# Altium project jetson-orin-baseboard.PrjPcb (part 3 of 5)

## Sheet csi.SchDoc
size 420 x 297 mm
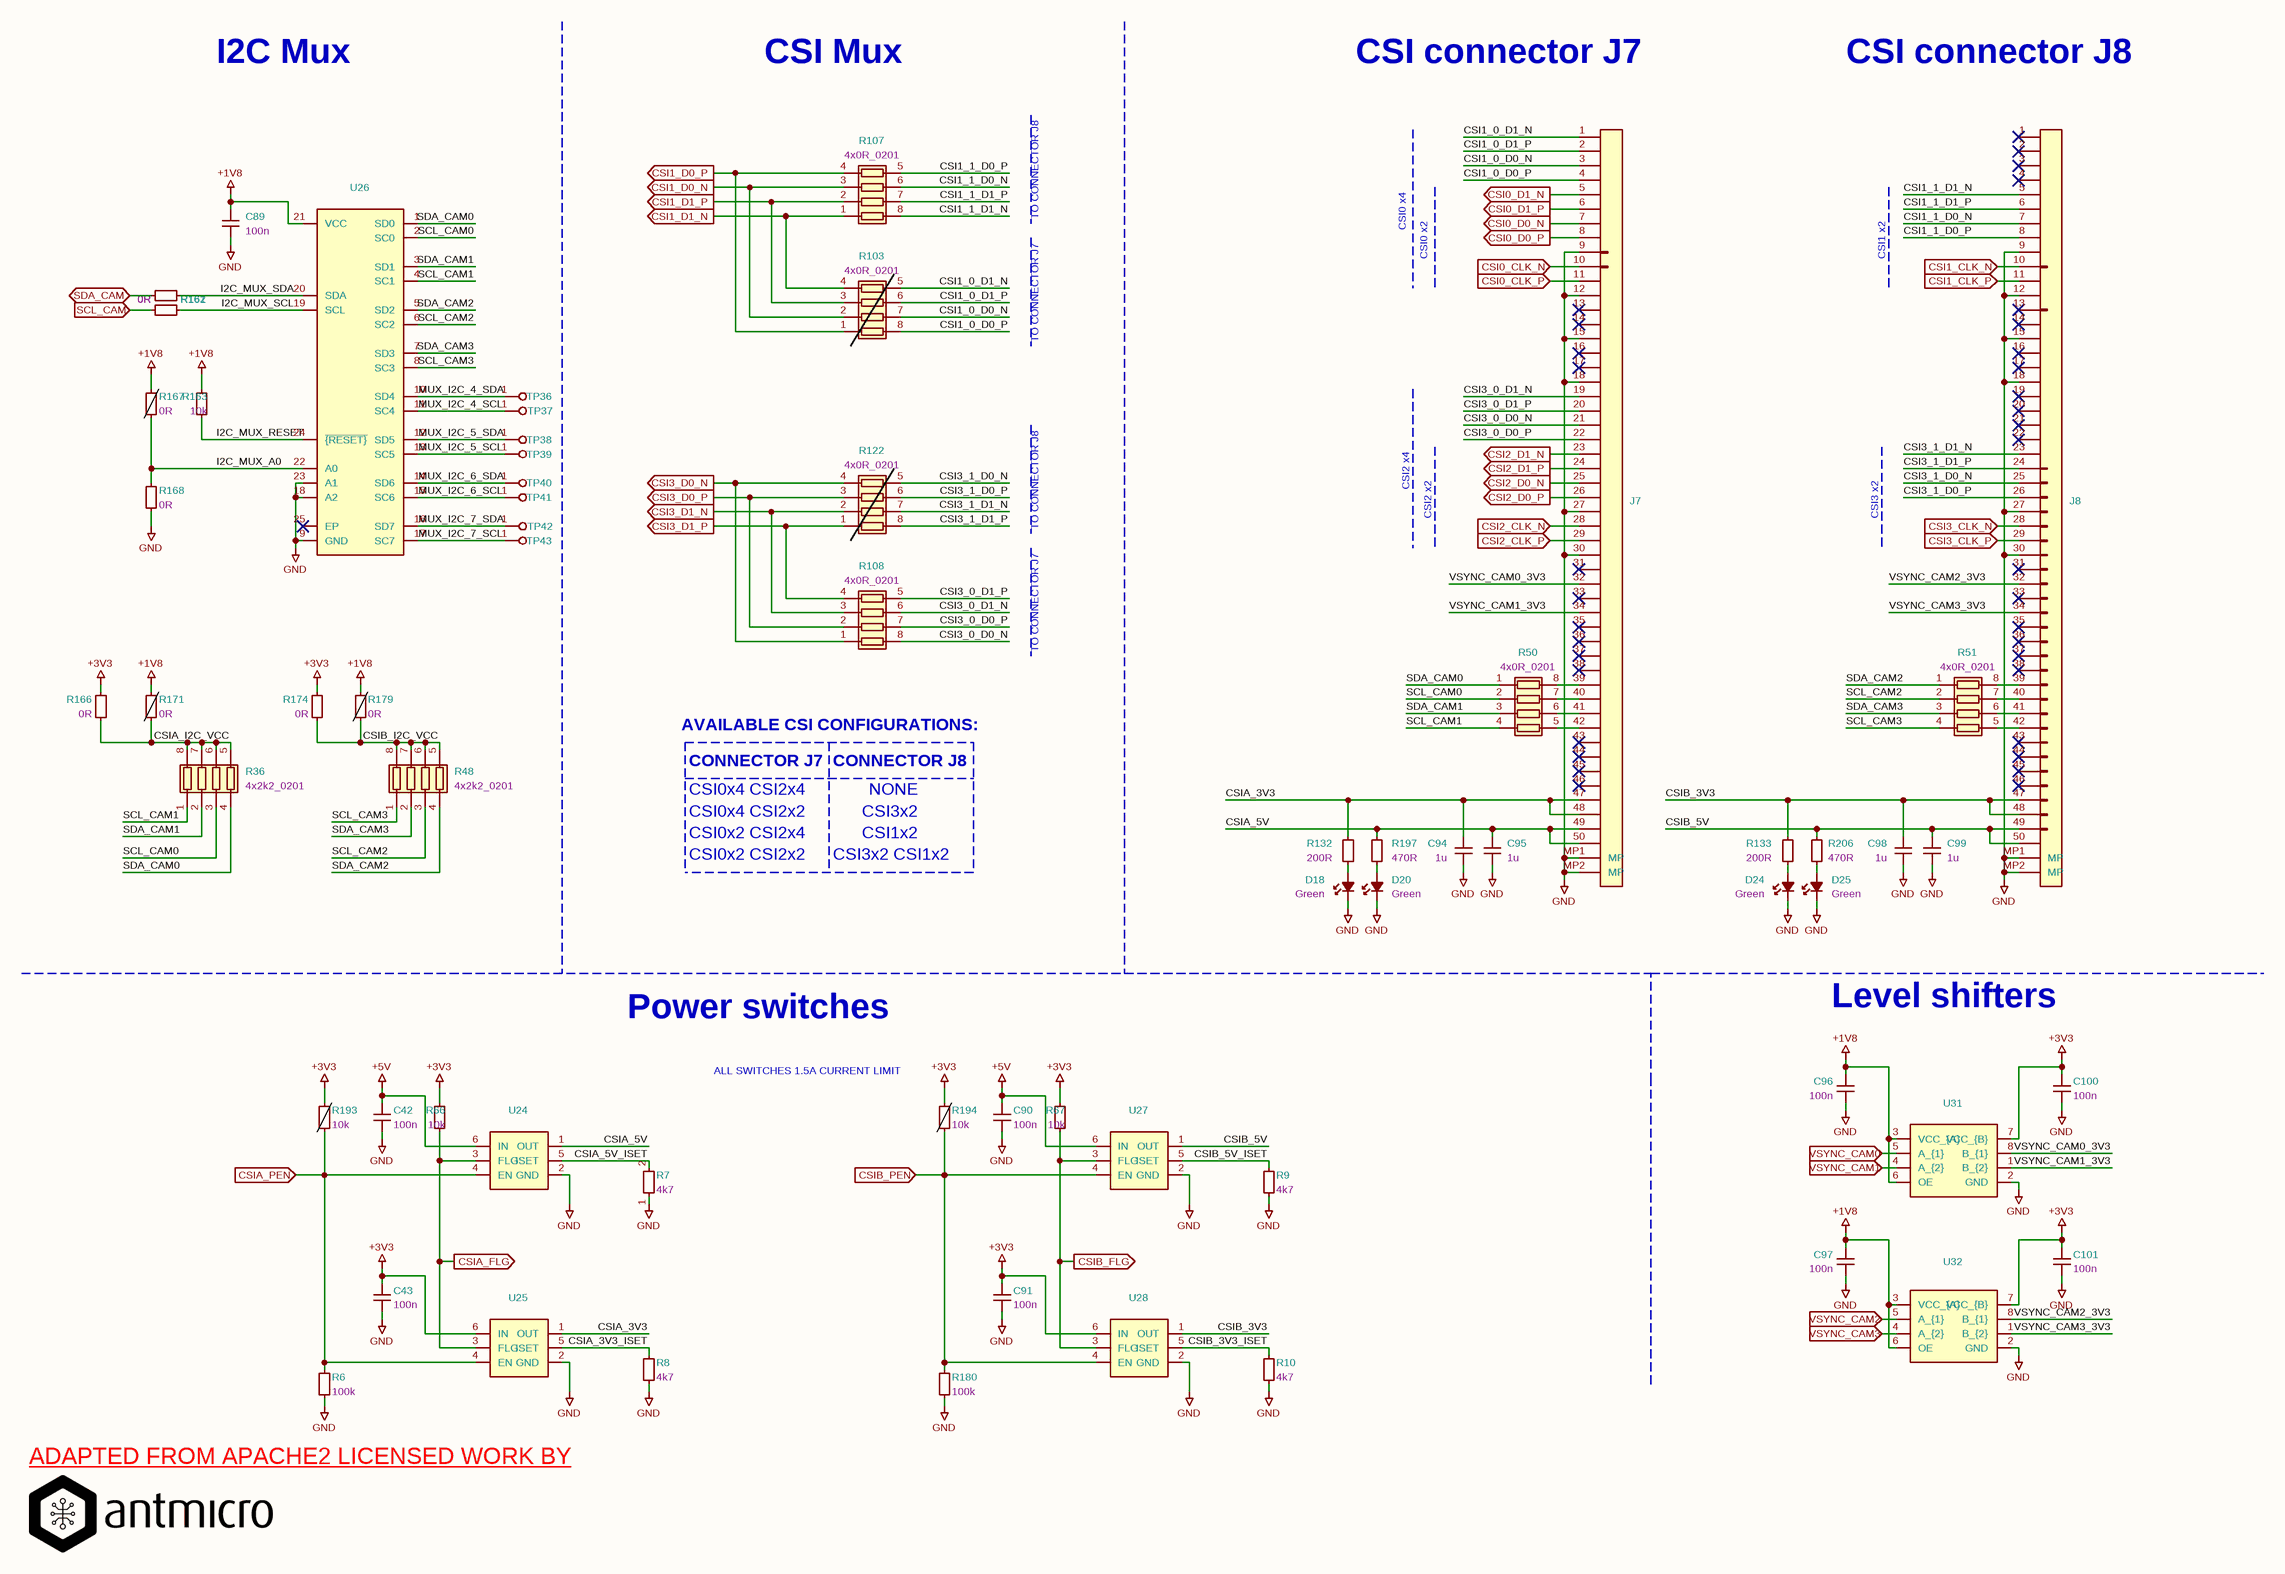
[diagram p7: csi.SchDoc]

### Parts
C42  Val: 100n  [C_0402_1005Metric]  (hidden comment: GRM155R61H104KE14D)
C43  Val: 100n  [C_0402_1005Metric]  (hidden comment: GRM155R61H104KE14D)
C89  Val: 100n  [C_0402_1005Metric]  (hidden comment: GRM155R61H104KE14D)
C90  Val: 100n  [C_0402_1005Metric]  (hidden comment: GRM155R61H104KE14D)
C91  Val: 100n  [C_0402_1005Metric]  (hidden comment: GRM155R61H104KE14D)
C94  Val: 1u  [C_0402_1005Metric]  (hidden comment: C1005X6S1A105K050BC)
C95  Val: 1u  [C_0402_1005Metric]  (hidden comment: C1005X6S1A105K050BC)
C96  Val: 100n  [C_0402_1005Metric]  (hidden comment: GRM155R61H104KE14D)
C97  Val: 100n  [C_0402_1005Metric]  (hidden comment: GRM155R61H104KE14D)
C98  Val: 1u  [C_0402_1005Metric]  (hidden comment: C1005X6S1A105K050BC)
C99  Val: 1u  [C_0402_1005Metric]  (hidden comment: C1005X6S1A105K050BC)
C100  Val: 100n  [C_0402_1005Metric]  (hidden comment: GRM155R61H104KE14D)
C101  Val: 100n  [C_0402_1005Metric]  (hidden comment: GRM155R61H104KE14D)
D18  Color: Green  [LED_0603_1608Metric_G]  (hidden comment: LTST-C190GKT)
D20  Color: Green  [LED_0603_1608Metric_G]  (hidden comment: LTST-C190GKT)
D24  Color: Green  [LED_0603_1608Metric_G]  (hidden comment: LTST-C190GKT)
D25  Color: Green  [LED_0603_1608Metric_G]  (hidden comment: LTST-C190GKT)
J7  68715014522  [Conn_FFC_WE_68715014x22]  (value not drawn)
J8  68715014522  [Conn_FFC_WE_68715014x22]  (value not drawn)
R6  Val: 100k  [R_0402_1005Metric]  (hidden comment: CR0402-FX-1003GLF)
R7  Val: 4k7  [R_0402_1005Metric]  (hidden comment: CR0402-FX-4701GLF)
R8  Val: 4k7  [R_0402_1005Metric]  (hidden comment: CR0402-FX-4701GLF)
R9  Val: 4k7  [R_0402_1005Metric]  (hidden comment: CR0402-FX-4701GLF)
R10  Val: 4k7  [R_0402_1005Metric]  (hidden comment: CR0402-FX-4701GLF)
R36  Val: 4x2k2_0201  [R_Array_4x0201_Panasonic_EXB18V]  (hidden comment: EXB-18V222JX)
R48  Val: 4x2k2_0201  [R_Array_4x0201_Panasonic_EXB18V]  (hidden comment: EXB-18V222JX)
R50  Val: 4x0R_0201  [R_Array_4x0201_Panasonic_EXB18V]  (hidden comment: EXB-18VR000X)
R51  Val: 4x0R_0201  [R_Array_4x0201_Panasonic_EXB18V]  (hidden comment: EXB-18VR000X)
R66  Val: 10k  [R_0402_1005Metric]  (hidden comment: CR0402-FX-1002GLF)
R67  Val: 10k  [R_0402_1005Metric]  (hidden comment: CR0402-FX-1002GLF)
R103  Val: 4x0R_0201  [R_Array_4x0201_Panasonic_EXB18V]  (hidden comment: EXB-18VR000X)  (no BOM)
R107  Val: 4x0R_0201  [R_Array_4x0201_Panasonic_EXB18V]  (hidden comment: EXB-18VR000X)
R108  Val: 4x0R_0201  [R_Array_4x0201_Panasonic_EXB18V]  (hidden comment: EXB-18VR000X)
R122  Val: 4x0R_0201  [R_Array_4x0201_Panasonic_EXB18V]  (hidden comment: EXB-18VR000X)  (no BOM)
R132  Val: 200R  [R_0402_1005Metric]  (hidden comment: CR0402-FX-2000GLF)
R133  Val: 200R  [R_0402_1005Metric]  (hidden comment: CR0402-FX-2000GLF)
R161  Val: 0R  [R_0402_1005Metric]  (hidden comment: ERJ2GE0R00X)
R162  Val: 0R  [R_0402_1005Metric]  (hidden comment: ERJ2GE0R00X)
R163  Val: 10k  [R_0402_1005Metric]  (hidden comment: CR0402-FX-1002GLF)
R166  Val: 0R  [R_0402_1005Metric]  (hidden comment: ERJ2GE0R00X)
R167  Val: 0R  [R_0402_1005Metric]  (hidden comment: ERJ2GE0R00X)  (no BOM)
R168  Val: 0R  [R_0402_1005Metric]  (hidden comment: ERJ2GE0R00X)
R171  Val: 0R  [R_0402_1005Metric]  (hidden comment: ERJ2GE0R00X)  (no BOM)
R174  Val: 0R  [R_0402_1005Metric]  (hidden comment: ERJ2GE0R00X)
R179  Val: 0R  [R_0402_1005Metric]  (hidden comment: ERJ2GE0R00X)  (no BOM)
R180  Val: 100k  [R_0402_1005Metric]  (hidden comment: CR0402-FX-1003GLF)
R193  Val: 10k  [R_0402_1005Metric]  (hidden comment: CR0402-FX-1002GLF)  (no BOM)
R194  Val: 10k  [R_0402_1005Metric]  (hidden comment: CR0402-FX-1002GLF)  (no BOM)
R197  Val: 470R  [R_0402_1005Metric]  (hidden comment: CR0402-FX-4700GLF)
R206  Val: 470R  [R_0402_1005Metric]  (hidden comment: CR0402-FX-4700GLF)
TP36  TP_0.75mm_SMD  [TP_SMD_0.75mm]  (value not drawn)  (no BOM)
TP37  TP_0.75mm_SMD  [TP_SMD_0.75mm]  (value not drawn)  (no BOM)
TP38  TP_0.75mm_SMD  [TP_SMD_0.75mm]  (value not drawn)  (no BOM)
TP39  TP_0.75mm_SMD  [TP_SMD_0.75mm]  (value not drawn)  (no BOM)
TP40  TP_0.75mm_SMD  [TP_SMD_0.75mm]  (value not drawn)  (no BOM)
TP41  TP_0.75mm_SMD  [TP_SMD_0.75mm]  (value not drawn)  (no BOM)
TP42  TP_0.75mm_SMD  [TP_SMD_0.75mm]  (value not drawn)  (no BOM)
TP43  TP_0.75mm_SMD  [TP_SMD_0.75mm]  (value not drawn)  (no BOM)
U24  AP22615AWU-7  [TSOT23-6]  (value not drawn)
U25  AP22615AWU-7  [TSOT23-6]  (value not drawn)
U26  PI4MSD5V9548AZDEX  [VQFN-24-1EP_3.8x3.8x1.0mm_P0.5mm]  (value not drawn)
U27  AP22615AWU-7  [TSOT23-6]  (value not drawn)
U28  AP22615AWU-7  [TSOT23-6]  (value not drawn)
U31  NTS0102GT  [XSON-8_1x1.95mm_P0.5mm]  (value not drawn)
U32  NTS0102GT  [XSON-8_1x1.95mm_P0.5mm]  (value not drawn)

### Ports
CSI0_CLK_N (in), CSI0_CLK_P (in), CSI0_D0_N (out), CSI0_D0_P (out), CSI0_D1_N (out), CSI0_D1_P (out), CSI1_CLK_N (in), CSI1_CLK_P (in), CSI1_D0_N (out), CSI1_D0_P (out), CSI1_D1_N (out), CSI1_D1_P (out), CSI2_CLK_N (in), CSI2_CLK_P (in), CSI2_D0_N (out), CSI2_D0_P (out), CSI2_D1_N (out), CSI2_D1_P (out), CSI3_CLK_N (in), CSI3_CLK_P (in), CSI3_D0_N (out), CSI3_D0_P (out), CSI3_D1_N (out), CSI3_D1_P (out), CSIA_FLG (out), CSIA_PEN (in), CSIB_FLG (out), CSIB_PEN (in), SCL_CAM (in), SDA_CAM (bidir), VSYNC_CAM0 (in), VSYNC_CAM1 (in), VSYNC_CAM2 (in), VSYNC_CAM3 (in)

### Nets
+1V8: C89.2 C96.2 C97.2 R163.1 R167.2 R171.2 R179.2 U26.21(VCC) U31.3(VCC_{A}) U31.6(OE) U32.3(VCC_{A}) U32.6(OE)
+3V3: C43.1 C91.1 C100.2 C101.2 R66.1 R67.1 R166.2 R174.2 R193.2 R194.2 U25.6(IN) U28.6(IN) U31.7(VCC_{B}) U32.7(VCC_{B})
+5V: C42.1 C90.1 U24.6(IN) U27.6(IN)
GND: C42.2 C43.2 C89.1 C90.2 C91.2 C94.1 C95.1 C96.1 C97.1 C98.1 C99.1 C100.1 C101.1 D18.1(C) D20.1(C) D24.1(C) D25.1(C) J7.9 J7.12 J7.15 J7.18 J7.27 J7.30 J7.MP1(MP) J7.MP2(MP) J8.9 J8.12 J8.15 J8.18 J8.27 J8.30 J8.MP1(MP) J8.MP2(MP) R6.1 R7.1 R8.1 R9.1 R10.1 R168.1 R180.1 U24.2(GND) U25.2(GND) U26.9(GND) U26.18(A2) U26.23(A1) U27.2(GND) U28.2(GND) U31.2(GND) U32.2(GND)
CSI0_CLK_N: J7.10 ; port CSI0_CLK_N
CSI0_CLK_P: J7.11 ; port CSI0_CLK_P
CSI0_D0_N: J7.7 ; port CSI0_D0_N
CSI0_D0_P: J7.8 ; port CSI0_D0_P
CSI0_D1_N: J7.5 ; port CSI0_D1_N
CSI0_D1_P: J7.6 ; port CSI0_D1_P
CSI1_0_D0_N: J7.3 R103.7(R2.2)
CSI1_0_D0_P: J7.4 R103.8(R1.2)
CSI1_0_D1_N: J7.1 R103.5(R4.2)
CSI1_0_D1_P: J7.2 R103.6(R3.2)
CSI1_1_D0_N: J8.7 R107.6(R3.2)
CSI1_1_D0_P: J8.8 R107.5(R4.2)
CSI1_1_D1_N: J8.5 R107.8(R1.2)
CSI1_1_D1_P: J8.6 R107.7(R2.2)
CSI1_CLK_N: J8.10 ; port CSI1_CLK_N
CSI1_CLK_P: J8.11 ; port CSI1_CLK_P
CSI1_D0_N: R103.2(R2.1) R107.3(R3.1) ; port CSI1_D0_N
CSI1_D0_P: R103.1(R1.1) R107.4(R4.1) ; port CSI1_D0_P
CSI1_D1_N: R103.4(R4.1) R107.1(R1.1) ; port CSI1_D1_N
CSI1_D1_P: R103.3(R3.1) R107.2(R2.1) ; port CSI1_D1_P
CSI2_CLK_N: J7.28 ; port CSI2_CLK_N
CSI2_CLK_P: J7.29 ; port CSI2_CLK_P
CSI2_D0_N: J7.25 ; port CSI2_D0_N
CSI2_D0_P: J7.26 ; port CSI2_D0_P
CSI2_D1_N: J7.23 ; port CSI2_D1_N
CSI2_D1_P: J7.24 ; port CSI2_D1_P
CSI3_0_D0_N: J7.21 R108.8(R1.2)
CSI3_0_D0_P: J7.22 R108.7(R2.2)
CSI3_0_D1_N: J7.19 R108.6(R3.2)
CSI3_0_D1_P: J7.20 R108.5(R4.2)
CSI3_1_D0_N: J8.25 R122.5(R4.2)
CSI3_1_D0_P: J8.26 R122.6(R3.2)
CSI3_1_D1_N: J8.23 R122.7(R2.2)
CSI3_1_D1_P: J8.24 R122.8(R1.2)
CSI3_CLK_N: J8.28 ; port CSI3_CLK_N
CSI3_CLK_P: J8.29 ; port CSI3_CLK_P
CSI3_D0_N: R108.1(R1.1) R122.4(R4.1) ; port CSI3_D0_N
CSI3_D0_P: R108.2(R2.1) R122.3(R3.1) ; port CSI3_D0_P
CSI3_D1_N: R108.3(R3.1) R122.2(R2.1) ; port CSI3_D1_N
CSI3_D1_P: R108.4(R4.1) R122.1(R1.1) ; port CSI3_D1_P
CSIA_3V3: C94.2 J7.47 J7.48 R132.2 U25.1(OUT)
CSIA_3V3_ISET: R8.2 U25.5(ISET)
CSIA_5V: C95.2 J7.49 J7.50 R197.2 U24.1(OUT)
CSIA_5V_ISET: R7.2 U24.5(ISET)
CSIA_FLG: R66.2 U24.3(FLG) U25.3(FLG) ; port CSIA_FLG
CSIA_I2C_VCC: R36.5(R4.2) R36.6(R3.2) R36.7(R2.2) R36.8(R1.2) R166.1 R171.1
CSIA_PEN: R6.2 R193.1 U24.4(EN) U25.4(EN) ; port CSIA_PEN
CSIB_3V3: C98.2 J8.47 J8.48 R133.2 U28.1(OUT)
CSIB_3V3_ISET: R10.2 U28.5(ISET)
CSIB_5V: C99.2 J8.49 J8.50 R206.2 U27.1(OUT)
CSIB_5V_ISET: R9.2 U27.5(ISET)
CSIB_FLG: R67.2 U27.3(FLG) U28.3(FLG) ; port CSIB_FLG
CSIB_I2C_VCC: R48.5(R4.2) R48.6(R3.2) R48.7(R2.2) R48.8(R1.2) R174.1 R179.1
CSIB_PEN: R180.2 R194.1 U27.4(EN) U28.4(EN) ; port CSIB_PEN
I2C_MUX_A0: R167.1 R168.2 U26.22(A0)
I2C_MUX_RESET: R163.2 U26.24(~{{RESET}})
I2C_MUX_SCL: R162.1 U26.19(SCL)
I2C_MUX_SDA: R161.1 U26.20(SDA)
MUX_I2C_4_SCL: TP37.1 U26.11(SC4)
MUX_I2C_4_SDA: TP36.1 U26.10(SD4)
MUX_I2C_5_SCL: TP39.1 U26.13(SC5)
MUX_I2C_5_SDA: TP38.1 U26.12(SD5)
MUX_I2C_6_SCL: TP41.1 U26.15(SC6)
MUX_I2C_6_SDA: TP40.1 U26.14(SD6)
MUX_I2C_7_SCL: TP43.1 U26.17(SC7)
MUX_I2C_7_SDA: TP42.1 U26.16(SD7)
SCL_CAM: R162.2 ; port SCL_CAM
SCL_CAM0: R36.3(R3.1) R50.2(R2.1) U26.2(SC0)
SCL_CAM1: R36.1(R1.1) R50.4(R4.1) U26.4(SC1)
SCL_CAM2: R48.3(R3.1) R51.2(R2.1) U26.6(SC2)
SCL_CAM3: R48.1(R1.1) R51.4(R4.1) U26.8(SC3)
SDA_CAM: R161.2 ; port SDA_CAM
SDA_CAM0: R36.4(R4.1) R50.1(R1.1) U26.1(SD0)
SDA_CAM1: R36.2(R2.1) R50.3(R3.1) U26.3(SD1)
SDA_CAM2: R48.4(R4.1) R51.1(R1.1) U26.5(SD2)
SDA_CAM3: R48.2(R2.1) R51.3(R3.1) U26.7(SD3)
VSYNC_CAM0: U31.5(A_{1}) ; port VSYNC_CAM0
VSYNC_CAM0_3V3: J7.32 U31.8(B_{1})
VSYNC_CAM1: U31.4(A_{2}) ; port VSYNC_CAM1
VSYNC_CAM1_3V3: J7.34 U31.1(B_{2})
VSYNC_CAM2: U32.5(A_{1}) ; port VSYNC_CAM2
VSYNC_CAM2_3V3: J8.32 U32.8(B_{1})
VSYNC_CAM3: U32.4(A_{2}) ; port VSYNC_CAM3
VSYNC_CAM3_3V3: J8.34 U32.1(B_{2})
NetD18_2: D18.2(A) R132.1
NetD20_2: D20.2(A) R197.1
NetD24_2: D24.2(A) R133.1
NetD25_2: D25.2(A) R206.1
NetJ7_39: J7.39 R50.8(R1.2)
NetJ7_40: J7.40 R50.7(R2.2)
NetJ7_41: J7.41 R50.6(R3.2)
NetJ7_42: J7.42 R50.5(R4.2)
NetJ8_39: J8.39 R51.8(R1.2)
NetJ8_40: J8.40 R51.7(R2.2)
NetJ8_41: J8.41 R51.6(R3.2)
NetJ8_42: J8.42 R51.5(R4.2)

Not connected (* = marked no-connect by the designer): J7 13* 14* 16* 17* 31* 33* 35* 36* 37* 38* 43* 44* 45* 46*; J8 1* 2* 3* 4* 13* 14* 16* 17* 19* 20* 21* 22* 31* 33* 35* 36* 37* 38* 43* 44* 45* 46*; U26 25(EP)*

### Notes on the sheet
- I2C Mux
- CSI Mux
- CSI connector J7
- CSI connector J8
- TO CONNECTOR J8
- CSI0 x4
- CSI0 x2
- CSI1 x2
- TO CONNECTOR J7
- CSI2 x4
- CSI2 x2
- CSI3 x2
- AVAILABLE CSI CONFIGURATIONS:
- CONNECTOR J7
- CSI0x4 CSI2x4
- CONNECTOR J8
- NONE
- CSI0x2 CSI2x2
- CSI0x4 CSI2x2
- CSI0x2 CSI2x4
- CSI3x2 CSI1x2
- CSI1x2
- CSI3x2
- Level shifters
- Power switches
- ALL SWITCHES
  1.5A CURRENT LIMIT
- (near R6) ADAPTED FROM APACHE2 LICENSED WORK BY <https://github.com/antmicro/jetson-orin-baseboard>
- 1
- 2
- 3
- 4
- 5
- 6
- 7
- 8
- A
- B
- C
- D
- E
- www.antmicro.com <http://www.antmicro.com>
- Title: Jetson Orin Baseboard
- File: csi.kicad_sch
- Sheet: /
- Antmicro Ltd
- F
- KiCad E.D.A.  kicad (5.1.4)-1
- Size: A3
- Date: 2025-01-15
- Rev: 1.3.0
- Id: 1/1

### Library data of the parts
C42 C43 C89-C91 C96 C97 C100 C101 = C_100n_0402: Manufacturer 1: Murata; License: Apache-2.0; Voltage: 50V; Dielectric: X5R; Author: Antmicro; OldValue: C_100n_0402; Manufacturer Part Number 1: GRM155R61H104KE14D; Value: GRM155R61H104KE14D; Footprint: antmicro-footprints:C_0402_1005Metric
C94 C95 C98 C99 = C_1u_0402: Manufacturer 1: TDK; License: Apache-2.0; Author: Antmicro; OldValue: C_1u_0402; Manufacturer Part Number 1: C1005X6S1A105K050BC; Value: C1005X6S1A105K050BC; Footprint: antmicro-footprints:C_0402_1005Metric
D18 D20 D24 D25 = LED_G_0603_LTST-C190GKT: Manufacturer 1: Lite-On; License: Apache-2.0; Author: Antmicro; OldValue: LED_G_0603_LTST-C190GKT; Manufacturer Part Number 1: LTST-C190GKT; Value: LTST-C190GKT; Footprint: antmicro-footprints:LED_0603_1608Metric_G
J7 J8 = Conn_FFC_WE_68715014522: Manufacturer 1: Würth Elektronik; License: Apache-2.0; Author: Antmicro; OldValue: Conn_FFC_WE_68715014522; Manufacturer Part Number 1: 68715014522; Value: 68715014522; Footprint: antmicro-footprints:Conn_FFC_WE_68715014x22
R6 R180 = R_100k_0402: Manufacturer 1: Bourns; License: Apache-2.0; Tolerance: 1%; Author: Antmicro; OldValue: R_100k_0402; Manufacturer Part Number 1: CR0402-FX-1003GLF; Value: CR0402-FX-1003GLF; Footprint: antmicro-footprints:R_0402_1005Metric
R7-R10 = R_4k7_0402: Manufacturer 1: Bourns; License: Apache-2.0; Tolerance: 1%; Author: Antmicro; OldValue: R_4k7_0402; Manufacturer Part Number 1: CR0402-FX-4701GLF; Value: CR0402-FX-4701GLF; Footprint: antmicro-footprints:R_0402_1005Metric
R36 R48 = R_4x2k2_0201_array: Manufacturer 1: Panasonic; License: Apache-2.0; Author: Antmicro; OldValue: R_4x2k2_0201_array; Manufacturer Part Number 1: EXB-18V222JX; Value: EXB-18V222JX; Footprint: antmicro-footprints:R_Array_4x0201_Panasonic_EXB18V
R50 R51 R103 R107 R108 R122 = R_4x0R_0201_array: Manufacturer 1: Panasonic; License: Apache-2.0; Author: Antmicro; OldValue: R_4x0R_0201_array; Manufacturer Part Number 1: EXB-18VR000X; Value: EXB-18VR000X; Footprint: antmicro-footprints:R_Array_4x0201_Panasonic_EXB18V
R66 R67 R163 R193 R194 = R_10k_0402: Manufacturer 1: Bourns; License: Apache-2.0; Tolerance: 1%; Author: Antmicro; OldValue: R_10k_0402; Manufacturer Part Number 1: CR0402-FX-1002GLF; Value: CR0402-FX-1002GLF; Footprint: antmicro-footprints:R_0402_1005Metric
R132 R133 = R_200R_0402: Manufacturer 1: Bourns; License: Apache-2.0; Tolerance: 1%; Author: Antmicro; OldValue: R_200R_0402; Manufacturer Part Number 1: CR0402-FX-2000GLF; Value: CR0402-FX-2000GLF; Footprint: antmicro-footprints:R_0402_1005Metric
R161 R162 R166-R168 R171 R174 R179 = R_0R_0402: as R1-R5 on sheet som; Author: Antmicro; OldValue: R_0R_0402; Manufacturer Part Number 1: ERJ2GE0R00X; Value: ERJ2GE0R00X; Footprint: antmicro-footprints:R_0402_1005Metric
R197 R206 = R_470R_0402: Manufacturer 1: Bourns; License: Apache-2.0; Tolerance: 1%; Author: Antmicro; OldValue: R_470R_0402; Manufacturer Part Number 1: CR0402-FX-4700GLF; Value: CR0402-FX-4700GLF; Footprint: antmicro-footprints:R_0402_1005Metric
TP36-TP43 = TP_0.75mm_SMD: License: Apache-2.0; Author: Antmicro; OldValue: TP_0.75mm_SMD; Value: TP_0.75mm_SMD; Footprint: antmicro-footprints:TP_SMD_0.75mm
U24 U25 U27 U28 = AP22615A_TSOT26: Manufacturer 1: Diodes Incorporated; License: Apache-2.0; Author: Antmicro; OldValue: AP22615A_TSOT26; Manufacturer Part Number 1: AP22615AWU-7; Value: AP22615AWU-7; Footprint: antmicro-footprints:TSOT23-6
U26 = PI4MSD5V9548AZDEX: Manufacturer 1: Diodes Incorporated; License: Apache-2.0; Author: Antmicro; OldValue: PI4MSD5V9548AZDEX; Manufacturer Part Number 1: PI4MSD5V9548AZDEX; Value: PI4MSD5V9548AZDEX; Footprint: antmicro-footprints:VQFN-24-1EP_3.8x3.8x1.0mm_P0.5mm
U31 U32 = NTS0102_XSON: Manufacturer 1: NXP; License: Apache-2.0; Author: Antmicro; OldValue: NTS0102_XSON; Manufacturer Part Number 1: NTS0102GT; Value: NTS0102GT; Footprint: antmicro-footprints:XSON-8_1x1.95mm_P0.5mm

## Sheet m-2.SchDoc
size 420 x 297 mm
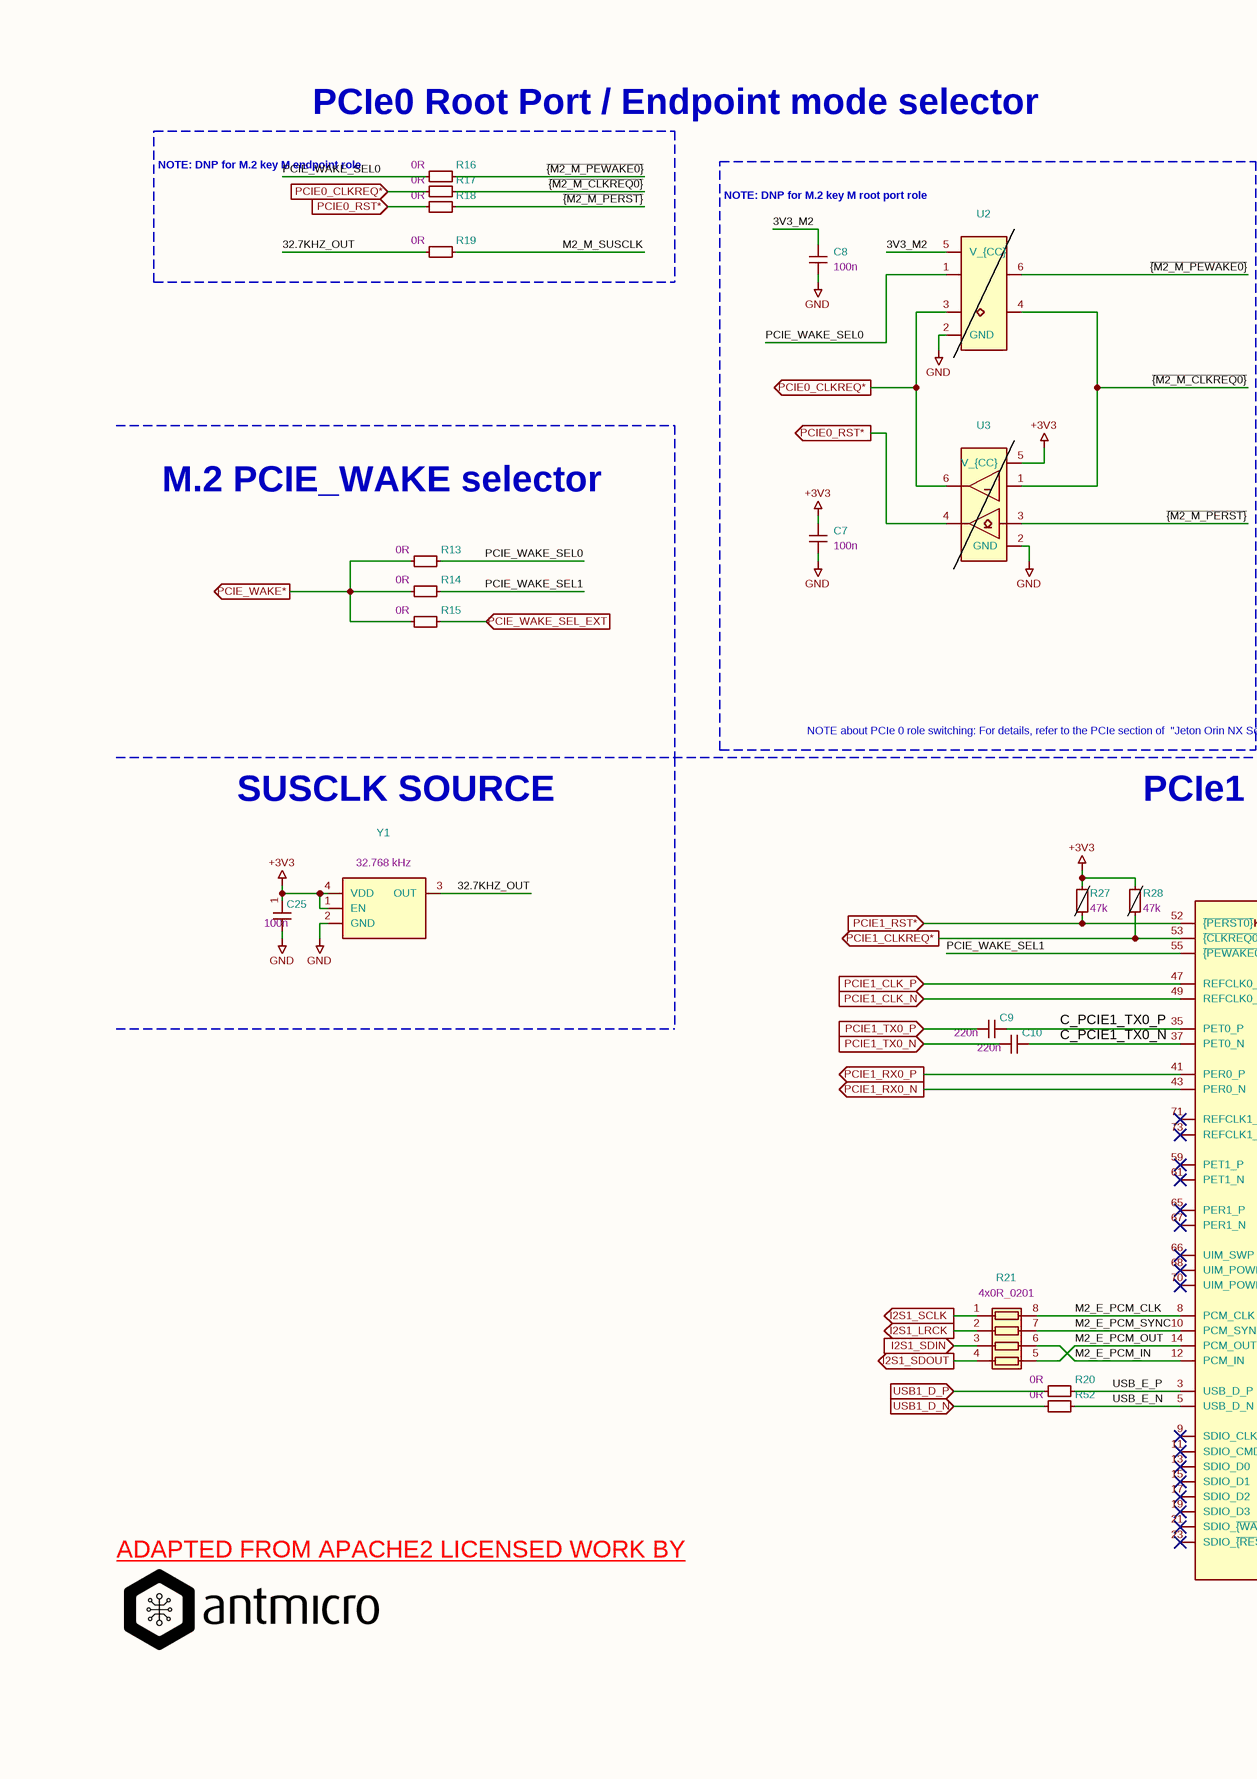
[diagram p8: m-2.SchDoc, left]
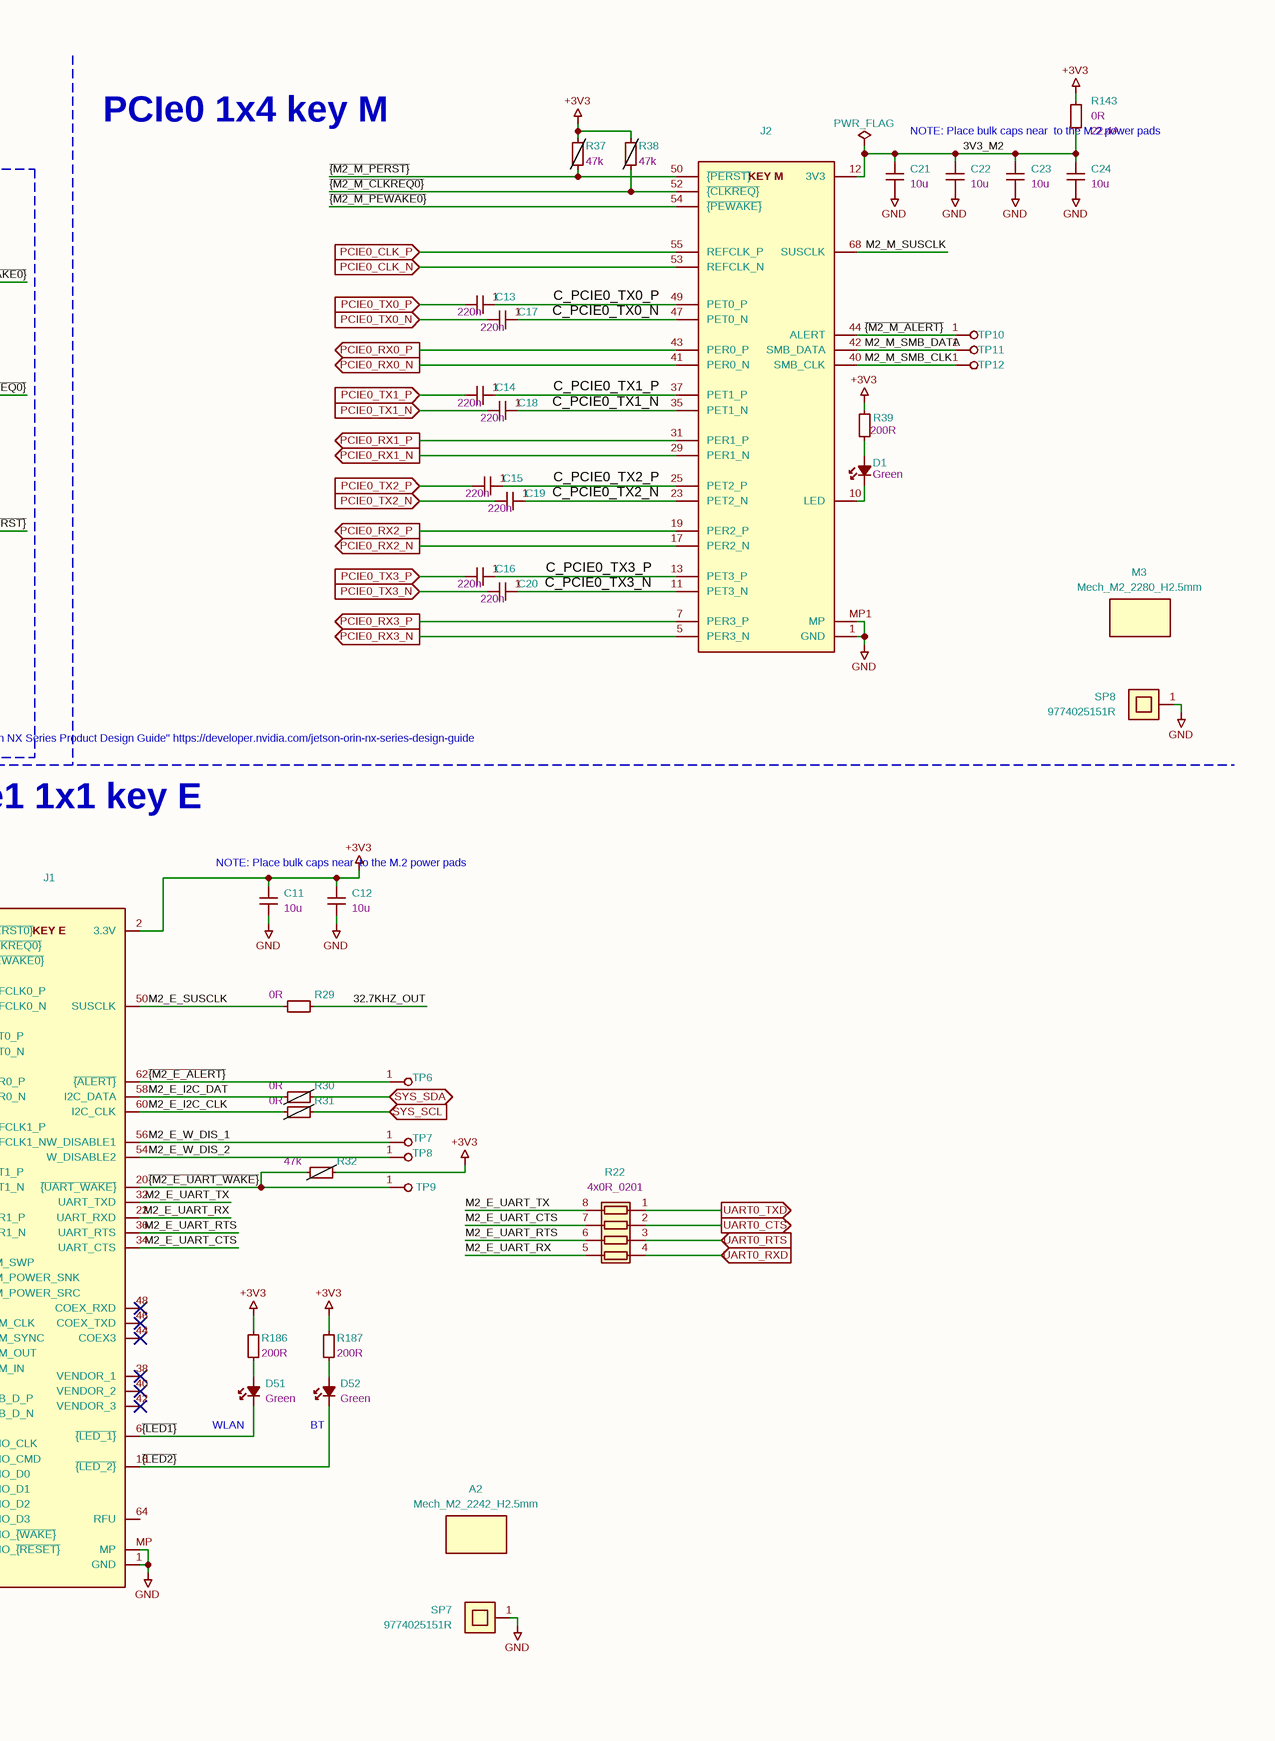
[diagram p9: m-2.SchDoc, right]

### Parts
#FLG02  PWR_FLAG  (graphical)
A2  Mech_M2_2242_H2.5mm  [Mech_M2_2242_H2.5mm]
C7  Val: 100n  [C_0402_1005Metric]  (hidden comment: GRM155R61H104KE14D)
C8  Val: 100n  [C_0402_1005Metric]  (hidden comment: GRM155R61H104KE14D)
C9  Val: 220n  [C_0402_1005Metric]  (hidden comment: CC0402KRX5R6BB224)
C10  Val: 220n  [C_0402_1005Metric]  (hidden comment: CC0402KRX5R6BB224)
C11  Val: 10u  [C_0603_1608Metric]  (hidden comment: GRM188R61A106KE69D)
C12  Val: 10u  [C_0603_1608Metric]  (hidden comment: GRM188R61A106KE69D)
C13  Val: 220n  [C_0402_1005Metric]  (hidden comment: CC0402KRX5R6BB224)
C14  Val: 220n  [C_0402_1005Metric]  (hidden comment: CC0402KRX5R6BB224)
C15  Val: 220n  [C_0402_1005Metric]  (hidden comment: CC0402KRX5R6BB224)
C16  Val: 220n  [C_0402_1005Metric]  (hidden comment: CC0402KRX5R6BB224)
C17  Val: 220n  [C_0402_1005Metric]  (hidden comment: CC0402KRX5R6BB224)
C18  Val: 220n  [C_0402_1005Metric]  (hidden comment: CC0402KRX5R6BB224)
C19  Val: 220n  [C_0402_1005Metric]  (hidden comment: CC0402KRX5R6BB224)
C20  Val: 220n  [C_0402_1005Metric]  (hidden comment: CC0402KRX5R6BB224)
C21  Val: 10u  [C_0603_1608Metric]  (hidden comment: GRM188R61A106KE69D)
C22  Val: 10u  [C_0603_1608Metric]  (hidden comment: GRM188R61A106KE69D)
C23  Val: 10u  [C_0603_1608Metric]  (hidden comment: GRM188R61A106KE69D)
C24  Val: 10u  [C_0603_1608Metric]  (hidden comment: GRM188R61A106KE69D)
C25  Val: 100n  [C_0402_1005Metric]  (hidden comment: GRM155R61H104KE14D)
D1  Color: Green  [LED_0603_1608Metric_G]  (hidden comment: LTST-C190GKT)
D51  Color: Green  [LED_0603_1608Metric_G]  (hidden comment: LTST-C190GKT)
D52  Color: Green  [LED_0603_1608Metric_G]  (hidden comment: LTST-C190GKT)
J1  2199230-6  [Bus_M.2_Socket_Key_E_TE_2199230-6]  (value not drawn)
J2  1-2199230-6  [Bus_M.2_Socket_Key_M_TE_1-2199230-6]  (value not drawn)
M3  Mech_M2_2280_H2.5mm  [Mech_M2_2280_H2.5mm]  (mechanical)
R13  Val: 0R  [R_0402_1005Metric]  (hidden comment: ERJ2GE0R00X)
R14  Val: 0R  [R_0402_1005Metric]  (hidden comment: ERJ2GE0R00X)
R15  Val: 0R  [R_0402_1005Metric]  (hidden comment: ERJ2GE0R00X)
R16  Val: 0R  [R_0402_1005Metric]  (hidden comment: ERJ2GE0R00X)
R17  Val: 0R  [R_0402_1005Metric]  (hidden comment: ERJ2GE0R00X)
R18  Val: 0R  [R_0402_1005Metric]  (hidden comment: ERJ2GE0R00X)
R19  Val: 0R  [R_0402_1005Metric]  (hidden comment: ERJ2GE0R00X)
R20  Val: 0R  [R_0402_1005Metric]  (hidden comment: ERJ2GE0R00X)
R21  Val: 4x0R_0201  [R_Array_4x0201_Panasonic_EXB18V]  (hidden comment: EXB-18VR000X)
R22  Val: 4x0R_0201  [R_Array_4x0201_Panasonic_EXB18V]  (hidden comment: EXB-18VR000X)
R27  Val: 47k  [R_0402_1005Metric]  (hidden comment: CR0402-FX-4702GLF)  (no BOM)
R28  Val: 47k  [R_0402_1005Metric]  (hidden comment: CR0402-FX-4702GLF)  (no BOM)
R29  Val: 0R  [R_0402_1005Metric]  (hidden comment: ERJ2GE0R00X)
R30  Val: 0R  [R_0402_1005Metric]  (hidden comment: ERJ2GE0R00X)  (no BOM)
R31  Val: 0R  [R_0402_1005Metric]  (hidden comment: ERJ2GE0R00X)  (no BOM)
R32  Val: 47k  [R_0402_1005Metric]  (hidden comment: CR0402-FX-4702GLF)  (no BOM)
R37  Val: 47k  [R_0402_1005Metric]  (hidden comment: CR0402-FX-4702GLF)  (no BOM)
R38  Val: 47k  [R_0402_1005Metric]  (hidden comment: CR0402-FX-4702GLF)  (no BOM)
R39  Val: 200R  [R_0402_1005Metric]  (hidden comment: CR0402-FX-2000GLF)
R52  Val: 0R  [R_0402_1005Metric]  (hidden comment: ERJ2GE0R00X)
R143  Val: 0R  Max. Curr.: 22.4A  [R_0603_1608Metric]  (hidden comment: PMR03EZPJ000)
R186  Val: 200R  [R_0402_1005Metric]  (hidden comment: CR0402-FX-2000GLF)
R187  Val: 200R  [R_0402_1005Metric]  (hidden comment: CR0402-FX-2000GLF)
SP7  9774025151R  [Spacer_Drill3.7mm_H2.5mm_9774025151R]
SP8  9774025151R  [Spacer_Drill3.7mm_H2.5mm_9774025151R]
TP6  TP_0.75mm_SMD  [TP_SMD_0.75mm]  (value not drawn)  (no BOM)
TP7  TP_0.75mm_SMD  [TP_SMD_0.75mm]  (value not drawn)  (no BOM)
TP8  TP_0.75mm_SMD  [TP_SMD_0.75mm]  (value not drawn)  (no BOM)
TP9  TP_0.75mm_SMD  [TP_SMD_0.75mm]  (value not drawn)  (no BOM)
TP10  TP_0.75mm_SMD  [TP_SMD_0.75mm]  (value not drawn)  (no BOM)
TP11  TP_0.75mm_SMD  [TP_SMD_0.75mm]  (value not drawn)  (no BOM)
TP12  TP_0.75mm_SMD  [TP_SMD_0.75mm]  (value not drawn)  (no BOM)
U2  74LVC2G07GV,125  [SC-74-6_1.5x2.9mm_P0.95mm]  (value not drawn)  (no BOM)
U3  74LVC2G07GV,125  [SC-74-6_1.5x2.9mm_P0.95mm]  (value not drawn)  (no BOM)
Y1  Val: 32.768 kHz  [Oscillator_SMD_ECS_2520MV_2.5x2mm]  (hidden comment: ECS-327MVATX-2-CN-TR3)

### Blocks framed on the sheet
PCIe0 Root Port / Endpoint mode selector: R16-R19
NOTE: / DNP for M.2 key M / root port role: C7 C8 U2 U3

### Ports
I2S1_LRCK (out), I2S1_SCLK (out), I2S1_SDIN (in), I2S1_SDOUT (out), PCIE0_CLK_N (in), PCIE0_CLK_P (in), PCIE0_CLKREQ* (in), PCIE0_CLKREQ* (out), PCIE0_RST* (in), PCIE0_RST* (out), PCIE0_RX0_N (out), PCIE0_RX0_P (out), PCIE0_RX1_N (out), PCIE0_RX1_P (out), PCIE0_RX2_N (out), PCIE0_RX2_P (out), PCIE0_RX3_N (out), PCIE0_RX3_P (out), PCIE0_TX0_N (in), PCIE0_TX0_P (in), PCIE0_TX1_N (in), PCIE0_TX1_P (in), PCIE0_TX2_N (in), PCIE0_TX2_P (in), PCIE0_TX3_N (in), PCIE0_TX3_P (in), PCIE1_CLK_N (in), PCIE1_CLK_P (in), PCIE1_CLKREQ* (out), PCIE1_RST* (in), PCIE1_RX0_N (out), PCIE1_RX0_P (out), PCIE1_TX0_N (in), PCIE1_TX0_P (in), PCIE_WAKE* (out), PCIE_WAKE_SEL_EXT (in), SYS_SCL (in), SYS_SDA (bidir), UART0_CTS (out), UART0_RTS (in), UART0_RXD (in), UART0_TXD (out), USB1_D_N (in), USB1_D_P (in)

### Nets
+3V3: C7.1 C11.1 C12.1 C25.1 J1.2(3.3V) R27.1 R28.1 R32.2 R37.1 R38.1 R39.2 R143.2 R186.2 R187.2 U3.5(V_{CC}) Y1.1(EN) Y1.4(VDD)
GND: C7.2 C8.2 C11.2 C12.2 C21.2 C22.2 C23.2 C24.2 C25.2 J1.1(GND) J1.MP J2.1(GND) J2.MP1(MP) SP7.1 SP8.1 U2.2(GND) U3.2(GND) Y1.2(GND)
3V3_M2: #FLG02.1(pwr) C8.1 C21.1 C22.1 C23.1 C24.1 J2.12(3V3) R143.1 U2.5(V_{CC})
32.7KHZ_OUT: R19.1 R29.2 Y1.3(OUT)
C_PCIE0_TX0_N: C17.1 J2.47(PET0_N)
C_PCIE0_TX0_P: C13.1 J2.49(PET0_P)
C_PCIE0_TX1_N: C18.1 J2.35(PET1_N)
C_PCIE0_TX1_P: C14.1 J2.37(PET1_P)
C_PCIE0_TX2_N: C19.1 J2.23(PET2_N)
C_PCIE0_TX2_P: C15.1 J2.25(PET2_P)
C_PCIE0_TX3_N: C20.1 J2.11(PET3_N)
C_PCIE0_TX3_P: C16.1 J2.13(PET3_P)
C_PCIE1_TX0_N: C10.2 J1.37(PET0_N)
C_PCIE1_TX0_P: C9.2 J1.35(PET0_P)
I2S1_LRCK: R21.2(R2.1) ; port I2S1_LRCK
I2S1_SCLK: R21.1(R1.1) ; port I2S1_SCLK
I2S1_SDIN: R21.3(R3.1) ; port I2S1_SDIN
I2S1_SDOUT: R21.4(R4.1) ; port I2S1_SDOUT
M2_E_I2C_CLK: J1.60(I2C_CLK) R31.1
M2_E_I2C_DAT: J1.58(I2C_DATA) R30.1
M2_E_PCM_CLK: J1.8(PCM_CLK) R21.8(R1.2)
M2_E_PCM_IN: J1.12(PCM_IN) R21.6(R3.2)
M2_E_PCM_OUT: J1.14(PCM_OUT) R21.5(R4.2)
M2_E_PCM_SYNC: J1.10(PCM_SYNC) R21.7(R2.2)
M2_E_SUSCLK: J1.50(SUSCLK) R29.1
M2_E_UART_CTS: J1.34(UART_CTS) R22.7(R2.2)
M2_E_UART_RTS: J1.36(UART_RTS) R22.6(R3.2)
M2_E_UART_RX: J1.22(UART_RXD) R22.5(R4.2)
M2_E_UART_TX: J1.32(UART_TXD) R22.8(R1.2)
M2_E_W_DIS_1: J1.56(W_DISABLE1) TP7.1
M2_E_W_DIS_2: J1.54(W_DISABLE2) TP8.1
M2_M_SMB_CLK: J2.40(SMB_CLK) TP12.1
M2_M_SMB_DATA: J2.42(SMB_DATA) TP11.1
M2_M_SUSCLK: J2.68(SUSCLK) R19.2
PCIE0_CLK_N: J2.53(REFCLK_N) ; port PCIE0_CLK_N
PCIE0_CLK_P: J2.55(REFCLK_P) ; port PCIE0_CLK_P
PCIE0_CLKREQ*: R17.1 U2.3 U3.6 ; port PCIE0_CLKREQ*
PCIE0_RST*: R18.1 U3.4 ; port PCIE0_RST*
PCIE0_RX0_N: J2.41(PER0_N) ; port PCIE0_RX0_N
PCIE0_RX0_P: J2.43(PER0_P) ; port PCIE0_RX0_P
PCIE0_RX1_N: J2.29(PER1_N) ; port PCIE0_RX1_N
PCIE0_RX1_P: J2.31(PER1_P) ; port PCIE0_RX1_P
PCIE0_RX2_N: J2.17(PER2_N) ; port PCIE0_RX2_N
PCIE0_RX2_P: J2.19(PER2_P) ; port PCIE0_RX2_P
PCIE0_RX3_N: J2.5(PER3_N) ; port PCIE0_RX3_N
PCIE0_RX3_P: J2.7(PER3_P) ; port PCIE0_RX3_P
PCIE0_TX0_N: C17.2 ; port PCIE0_TX0_N
PCIE0_TX0_P: C13.2 ; port PCIE0_TX0_P
PCIE0_TX1_N: C18.2 ; port PCIE0_TX1_N
PCIE0_TX1_P: C14.2 ; port PCIE0_TX1_P
PCIE0_TX2_N: C19.2 ; port PCIE0_TX2_N
PCIE0_TX2_P: C15.2 ; port PCIE0_TX2_P
PCIE0_TX3_N: C20.2 ; port PCIE0_TX3_N
PCIE0_TX3_P: C16.2 ; port PCIE0_TX3_P
PCIE1_CLK_N: J1.49(REFCLK0_N) ; port PCIE1_CLK_N
PCIE1_CLK_P: J1.47(REFCLK0_P) ; port PCIE1_CLK_P
PCIE1_CLKREQ*: J1.53(~{{CLKREQ0}}) R28.2 ; port PCIE1_CLKREQ*
PCIE1_RST*: J1.52(~{{PERST0}}) R27.2 ; port PCIE1_RST*
PCIE1_RX0_N: J1.43(PER0_N) ; port PCIE1_RX0_N
PCIE1_RX0_P: J1.41(PER0_P) ; port PCIE1_RX0_P
PCIE1_TX0_N: C10.1 ; port PCIE1_TX0_N
PCIE1_TX0_P: C9.1 ; port PCIE1_TX0_P
PCIE_WAKE*: R13.1 R14.1 R15.1 ; port PCIE_WAKE*
PCIE_WAKE_SEL0: R13.2 R16.1 U2.1
PCIE_WAKE_SEL1: J1.55(~{{PEWAKE0}}) R14.2
PCIE_WAKE_SEL_EXT: R15.2 ; port PCIE_WAKE_SEL_EXT
SYS_SCL: R31.2 ; port SYS_SCL
SYS_SDA: R30.2 ; port SYS_SDA
UART0_CTS: R22.2(R2.1) ; port UART0_CTS
UART0_RTS: R22.3(R3.1) ; port UART0_RTS
UART0_RXD: R22.4(R4.1) ; port UART0_RXD
UART0_TXD: R22.1(R1.1) ; port UART0_TXD
USB1_D_N: R52.1 ; port USB1_D_N
USB1_D_P: R20.1 ; port USB1_D_P
USB_E_N: J1.5(USB_D_N) R52.2
USB_E_P: J1.3(USB_D_P) R20.2
~{{LED1}}: D51.1(C) J1.6(~{{LED_1}})
~{{LED2}}: D52.1(C) J1.16(~{{LED_2}})
~{{M2_E_ALERT}}: J1.62(~{{ALERT}}) TP6.1
~{{M2_E_UART_WAKE}}: J1.20(~{{UART_WAKE}}) R32.1 TP9.1
~{{M2_M_ALERT}}: J2.44(ALERT) TP10.1
~{{M2_M_CLKREQ0}}: J2.52(~{{CLKREQ}}) R17.2 R38.2 U2.4 U3.1
~{{M2_M_PERST}}: J2.50(~{{PERST}}) R18.2 R37.2 U3.3
~{{M2_M_PEWAKE0}}: J2.54(~{{PEWAKE}}) R16.2 U2.6
NetD1_1: D1.1(C) J2.10(LED)
NetD1_2: D1.2(A) R39.1
NetD51_2: D51.2(A) R186.1
NetD52_2: D52.2(A) R187.1

Not connected (* = marked no-connect by the designer): J1 4(3.3V) 7(GND) 9(SDIO_CLK)* 11(SDIO_CMD)* 13(SDIO_D0)* 15(SDIO_D1)* 17(SDIO_D2)* 18(GND) 19(SDIO_D3)* 21(SDIO_~{{WAKE}})* 23(SDIO_~{{RESET}})* 33(GND) 38(VENDOR_1)* 39(GND) 40(VENDOR_2)* 42(VENDOR_3)* 44(COEX3)* 45(GND) 46(COEX_TXD)* 48(COEX_RXD)* 51(GND) 57(GND) 59(PET1_P)* 61(PET1_N)* 63(GND) 64(RFU) 65(PER1_P)* 66(UIM_SWP)* 67(PER1_N)* 68(UIM_POWER_SNK)* 69(GND) 70(UIM_POWER_SRC)* 71(REFCLK1_P)* 72(3.3V) 73(REFCLK1_N)* 74(3.3V) 75(GND); J2 2(3V3) 3(GND) 4(3V3) 6(NC) 8(NC) 9(GND) 14(3V3) 15(GND) 16(3V3) 18(3V3) 20(NC) 21(GND) 22(NC) 24(NC) 26(NC) 27(GND) 28(NC) 30(NC) 32(NC) 33(GND) 34(NC) 36(NC) 38(NC) 39(GND) 45(GND) 46(NC) 48(NC) 51(GND) 56(NC) 57(GND) 58(NC) 67(NC) 69(NC) 70(3V3) 71(GND) 72(3V3) 73(GND) 74(3V3) 75(GND) MP2(MP)

### Notes on the sheet
- NOTE:
  DNP for M.2 key M
  endpoint role
- PCIe0 1x4 key M
- (near R143) NOTE:
  Place bulk caps near
  to the M.2 power pads
- M.2 PCIE_WAKE selector
- NOTE about PCIe 0 role switching:
  For details, refer to the PCIe section of
  "Jeton Orin NX Series Product Design Guide"
  https://developer.nvidia.com/jetson-orin-nx-series-design-guide
- SUSCLK SOURCE
- PCIe1 1x1 key E
- NOTE:
  Place bulk caps near
  to the M.2 power pads
- (near D51) WLAN
- (near D52) BT
- ADAPTED FROM APACHE2 LICENSED WORK BY <https://github.com/antmicro/jetson-orin-baseboard>
- 1
- 2
- 3
- 4
- 5
- 6
- 7
- 8
- A
- B
- C
- D
- E
- www.antmicro.com <http://www.antmicro.com>
- Title: Jetson Orin Baseboard
- File: m-2.kicad_sch
- Sheet: /
- Antmicro Ltd
- F
- KiCad E.D.A.  kicad (5.1.4)-1
- Size: A3
- Date: 2025-01-15
- Rev: 1.3.0
- Id: 1/1
- (in symbol Bus_M.2_1-2199230-6) KEY M
- (in symbol Bus_M.2_2199230-6) KEY E

### Library data of the parts
A2 = Mech_M2_2242_H2.5mm: License: Apache-2.0; Author: Antmicro; OldValue: Mech_M2_2242_H2.5mm; Value: Mech_M2_2242_H2.5mm; Footprint: antmicro-footprints:Mech_M2_2242_H2.5mm
C7 C8 C25 = C_100n_0402: as C42 on sheet csi; Author: Antmicro; OldValue: C_100n_0402; Manufacturer Part Number 1: GRM155R61H104KE14D; Value: GRM155R61H104KE14D; Footprint: antmicro-footprints:C_0402_1005Metric
C9 C10 C13-C20 = C_220n_0402: Manufacturer 1: YAGEO; License: Apache-2.0; Author: Antmicro; OldValue: C_220n_0402; Manufacturer Part Number 1: CC0402KRX5R6BB224; Value: CC0402KRX5R6BB224; Footprint: antmicro-footprints:C_0402_1005Metric
C11 C12 C21-C24 = C_10u_0603: Manufacturer 1: Murata; License: Apache-2.0; Dielectric: template_dielectric; Author: Antmicro; OldValue: C_10u_0603; Manufacturer Part Number 1: GRM188R61A106KE69D; Value: GRM188R61A106KE69D; Footprint: antmicro-footprints:C_0603_1608Metric
D1 D51 D52 = LED_G_0603_LTST-C190GKT: as D18 on sheet csi; Author: Antmicro; OldValue: LED_G_0603_LTST-C190GKT; Manufacturer Part Number 1: LTST-C190GKT; Value: LTST-C190GKT; Footprint: antmicro-footprints:LED_0603_1608Metric_G
J1 = Bus_M.2_2199230-6: Manufacturer 1: TE Connectivity; License: Apache-2.0; Author: Antmicro; OldValue: Bus_M.2_2199230-6; Manufacturer Part Number 1: 2199230-6; Value: 2199230-6; Footprint: antmicro-footprints:Bus_M.2_Socket_Key_E_TE_2199230-6
J2 = Bus_M.2_1-2199230-6: Manufacturer 1: TE Connectivity; License: Apache-2.0; Author: Antmicro; OldValue: Bus_M.2_1-2199230-6; Manufacturer Part Number 1: 1-2199230-6; Value: 1-2199230-6; Footprint: antmicro-footprints:Bus_M.2_Socket_Key_M_TE_1-2199230-6
M3 = Mech_M2_2280_H2.5mm: License: Apache-2.0; Author: Antmicro; OldValue: Mech_M2_2280_H2.5mm; Value: Mech_M2_2280_H2.5mm; Footprint: antmicro-footprints:Mech_M2_2280_H2.5mm
R13-R20 R29-R31 R52 = R_0R_0402: as R1-R5 on sheet som; Author: Antmicro; OldValue: R_0R_0402; Manufacturer Part Number 1: ERJ2GE0R00X; Value: ERJ2GE0R00X; Footprint: antmicro-footprints:R_0402_1005Metric
R21 R22 = R_4x0R_0201_array: as R50 on sheet csi; Author: Antmicro; OldValue: R_4x0R_0201_array; Manufacturer Part Number 1: EXB-18VR000X; Value: EXB-18VR000X; Footprint: antmicro-footprints:R_Array_4x0201_Panasonic_EXB18V
R27 R28 R32 R37 R38 = R_47k_0402: Manufacturer 1: Bourns; License: Apache-2.0; Tolerance: 1%; Author: Antmicro; OldValue: R_47k_0402; Manufacturer Part Number 1: CR0402-FX-4702GLF; Value: CR0402-FX-4702GLF; Footprint: antmicro-footprints:R_0402_1005Metric
R39 R186 R187 = R_200R_0402: as R132 on sheet csi; Author: Antmicro; OldValue: R_200R_0402; Manufacturer Part Number 1: CR0402-FX-2000GLF; Value: CR0402-FX-2000GLF; Footprint: antmicro-footprints:R_0402_1005Metric
R143 = R_0R_22.4A_0603: Manufacturer 1: ROHM Semiconductor; License: Apache-2.0; Tolerance: template_tolerance; Author: Antmicro; OldValue: R_0R_22.4A_0603; Manufacturer Part Number 1: PMR03EZPJ000; Value: PMR03EZPJ000; Footprint: antmicro-footprints:R_0603_1608Metric
SP7 = Spacer_Drill3.7mm_H2.5mm_9774025151R: Manufacturer 1: Würth Elektronik; License: Apache-2.0; Author: Antmicro; OldValue: Spacer_Drill3.7mm_H2.5mm_9774025151R; Manufacturer Part Number 1: 9774025151R; Value: 9774025151R; Footprint: antmicro-footprints:Spacer_Drill3.7mm_H2.5mm_9774025151R
SP8 = Spacer_Drill3.7mm_H2.5mm_9774025151R_1: Manufacturer 1: Würth Elektronik; License: Apache-2.0; Author: Antmicro; OldValue: Spacer_Drill3.7mm_H2.5mm_9774025151R; Manufacturer Part Number 1: 9774025151R; Value: 9774025151R; Footprint: antmicro-footprints:Spacer_Drill3.7mm_H2.5mm_9774025151R
TP6-TP9 = TP_0.75mm_SMD: License: Apache-2.0; Author: Antmicro; OldValue: TP_0.75mm_SMD; Value: TP_0.75mm_SMD; Footprint: antmicro-footprints:TP_SMD_0.75mm
TP10 = TP_0.75mm_SMD_1: License: Apache-2.0; Author: Antmicro; OldValue: TP_0.75mm_SMD; Value: TP_0.75mm_SMD; Footprint: antmicro-footprints:TP_SMD_0.75mm
TP11 = TP_0.75mm_SMD_2: License: Apache-2.0; Author: Antmicro; OldValue: TP_0.75mm_SMD; Value: TP_0.75mm_SMD; Footprint: antmicro-footprints:TP_SMD_0.75mm
TP12 = TP_0.75mm_SMD_3: License: Apache-2.0; Author: Antmicro; OldValue: TP_0.75mm_SMD; Value: TP_0.75mm_SMD; Footprint: antmicro-footprints:TP_SMD_0.75mm
U2 U3 = 74LVC2G07_SOT457: Manufacturer 1: Nexperia; License: Apache-2.0; Author: Antmicro; OldValue: 74LVC2G07_SOT457; Manufacturer Part Number 1: 74LVC2G07GV,125; Value: 74LVC2G07GV,125; Footprint: antmicro-footprints:SC-74-6_1.5x2.9mm_P0.95mm
Y1 = Oscillator_32.768kHz_ECS_2520MV: Manufacturer 1: ECS Inc. International; License: Apache-2.0; Author: Antmicro; OldValue: Oscillator_32.768kHz_ECS_2520MV; Manufacturer Part Number 1: ECS-327MVATX-2-CN-TR3; Value: ECS-327MVATX-2-CN-TR3; Footprint: antmicro-footprints:Oscillator_SMD_ECS_2520MV_2.5x2mm
#FLG02 = PWR_FLAG: Value: PWR_FLAG

## Sheet ethernet.SchDoc
size 420 x 297 mm
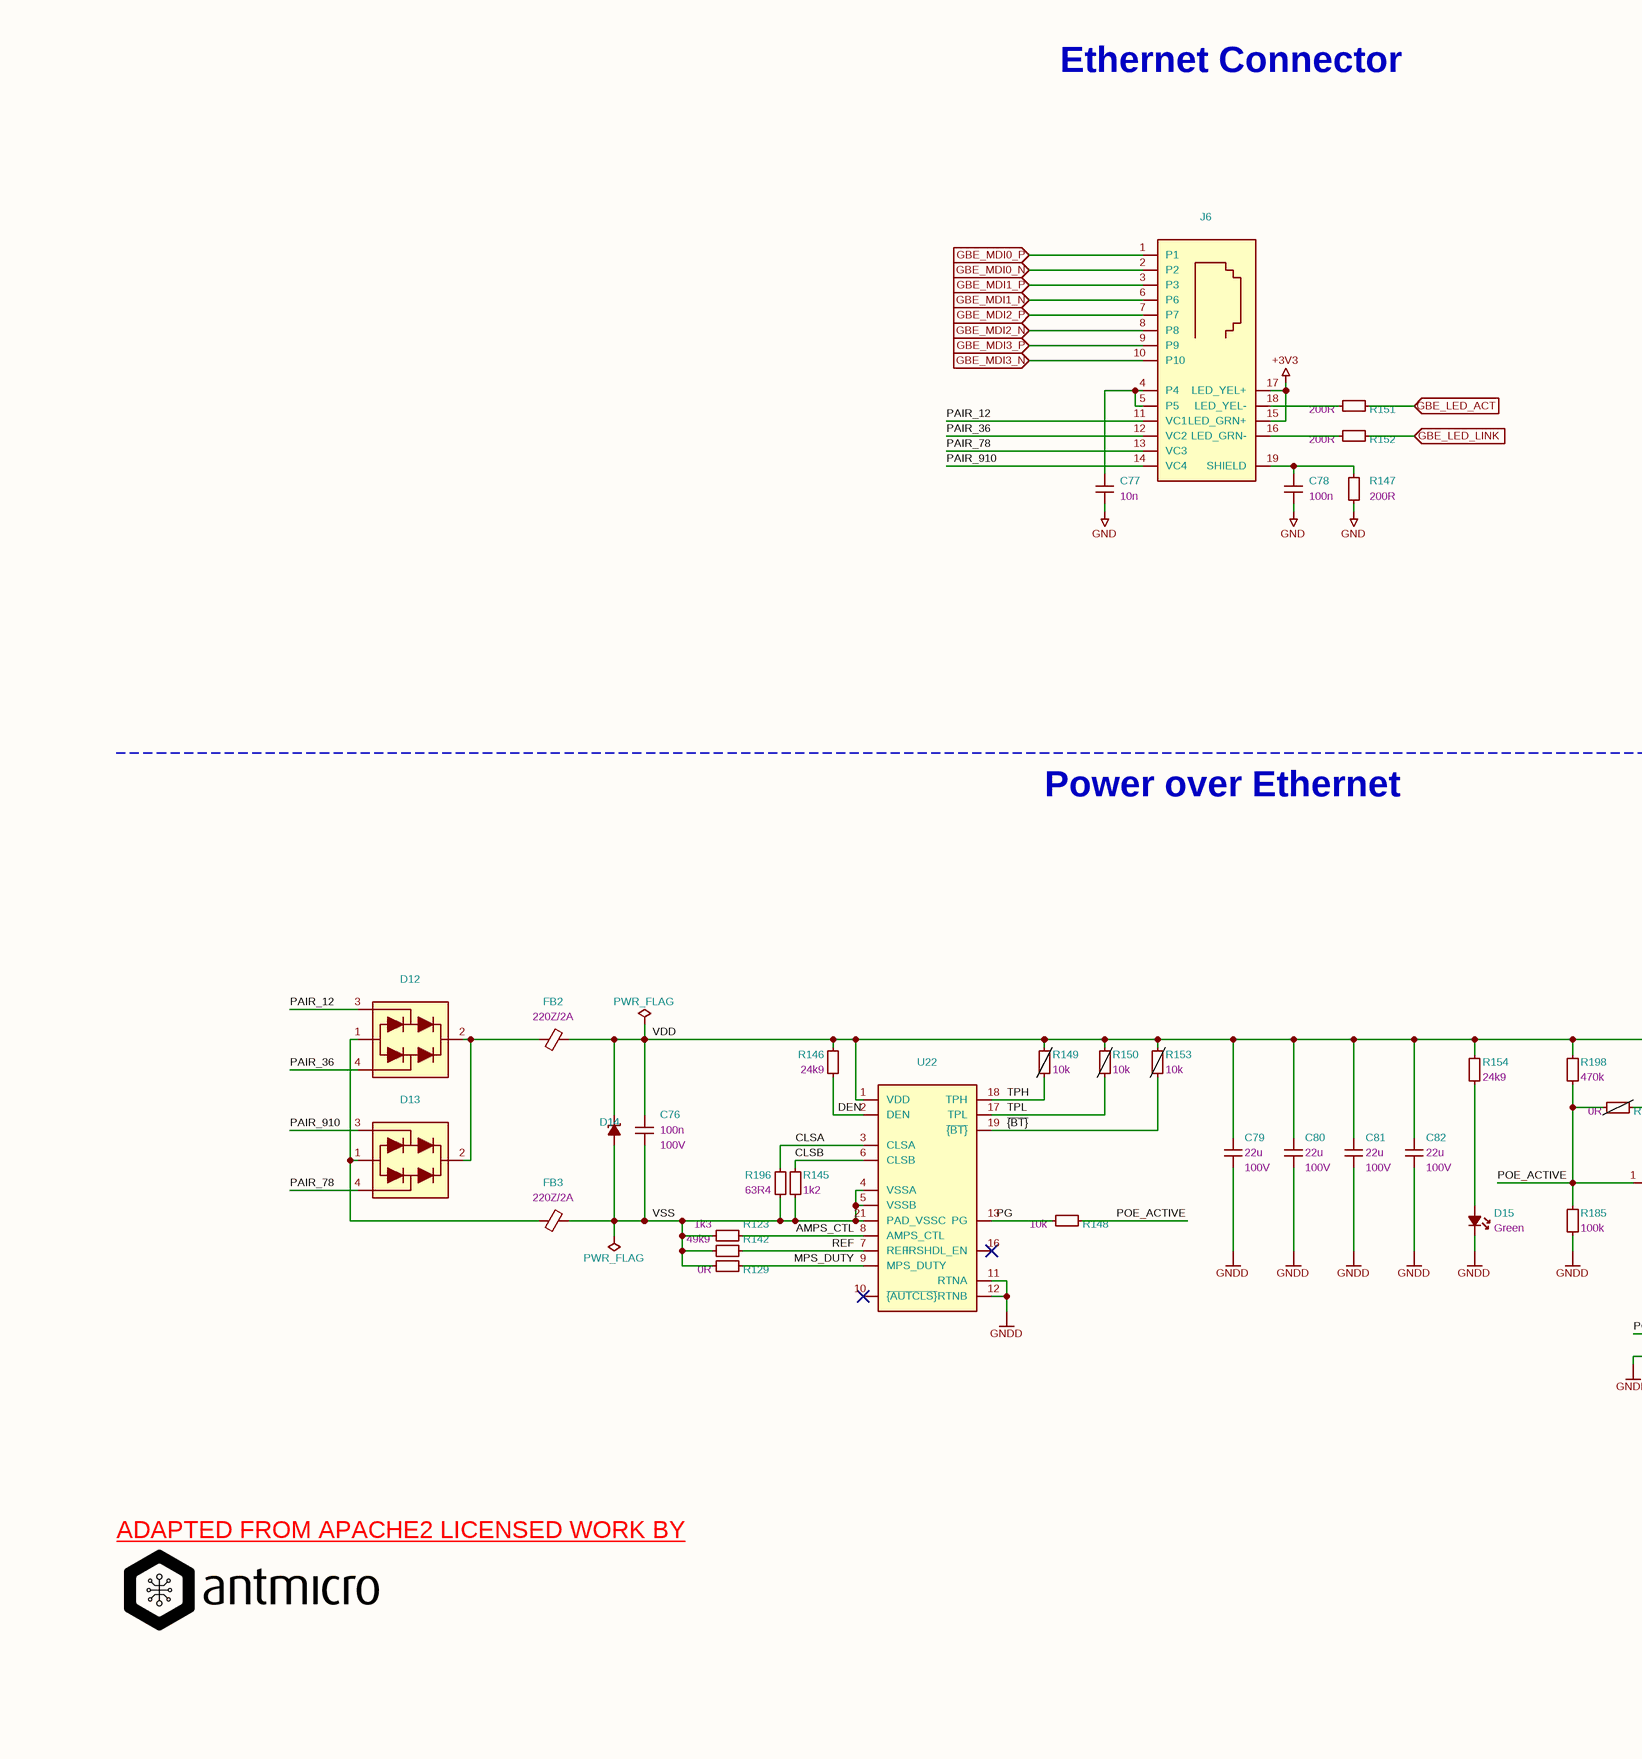
[diagram p10: ethernet.SchDoc, left]
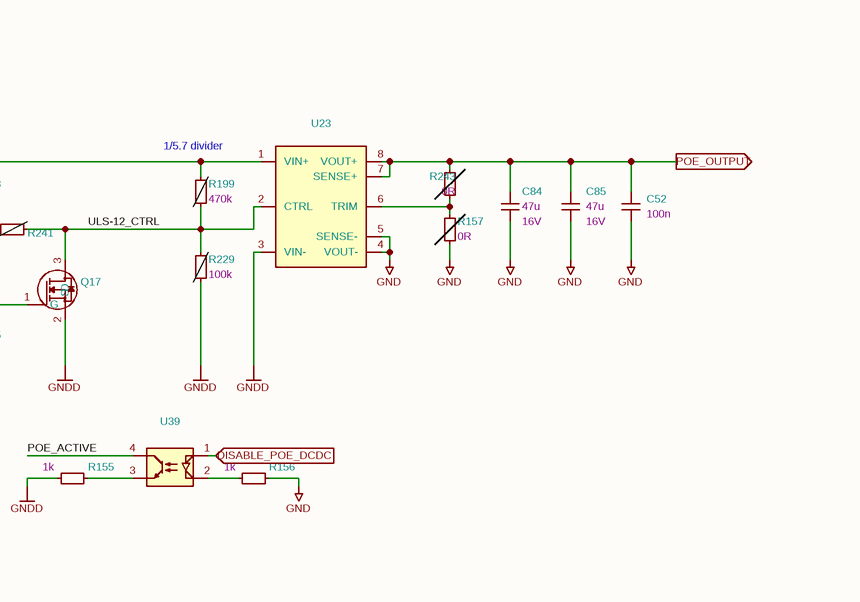
[diagram p11: ethernet.SchDoc, right]

### Parts
#FLG09  PWR_FLAG  (graphical)
#FLG010  PWR_FLAG  (graphical)
C52  Val: 100n  [C_0402_1005Metric]  (hidden comment: GRM155R61H104KE14D)
C76  Val: 100n  Voltage: 100V  [C_0805_2012Metric]  (hidden comment: CL21B104KCFNNNE)
C77  Val: 10n  [C_0603_1608Metric]  (hidden comment: 06031C103JAT2A)
C78  Val: 100n  [C_0402_1005Metric]  (hidden comment: GRM155R61H104KE14D)
C79  Val: 22u  Voltage: 100V  [C_2220_5650Metric]  (hidden comment: C5750X7S2A226M280KB)
C80  Val: 22u  Voltage: 100V  [C_2220_5650Metric]  (hidden comment: C5750X7S2A226M280KB)
C81  Val: 22u  Voltage: 100V  [C_2220_5650Metric]  (hidden comment: C5750X7S2A226M280KB)
C82  Val: 22u  Voltage: 100V  [C_2220_5650Metric]  (hidden comment: C5750X7S2A226M280KB)
C84  Val: 47u  Voltage: 16V  [C_1206_3216Metric]  (hidden comment: C3216X5R1C476M160AB)
C85  Val: 47u  Voltage: 16V  [C_1206_3216Metric]  (hidden comment: C3216X5R1C476M160AB)
D12  CD-MMBL110S  [DFN3538]  (value not drawn)
D13  CD-MMBL110S  [DFN3538]  (value not drawn)
D14  PTVS58VS1UR,115  [D_SOD-123F]  (value not drawn)
D15  Color: Green  [LED_0603_1608Metric_G]  (hidden comment: LTST-C190GKT)
FB2  Val: 220Z/2A  [FB_0805_2012Metric]  (hidden comment: BLM21PG221SN1D)
FB3  Val: 220Z/2A  [FB_0805_2012Metric]  (hidden comment: BLM21PG221SN1D)
J6  5-2337992-8  [RJ45_X-2337992-8_Horizontal]  (value not drawn)
Q17  PJE138K_R1_00001  [SOT-523]  (value not drawn)
R123  Val: 1k3  [R_0402_1005Metric]  (hidden comment: CR0402-FX-1301GLF)
R129  Val: 0R  [R_0402_1005Metric]  (hidden comment: ERJ2GE0R00X)
R142  Val: 49k9  [R_0402_1005Metric]  (hidden comment: CR0402-FX-4992GLF)
R145  Val: 1k2  [R_0402_1005Metric]  (hidden comment: CR0402-FX-1201GLF)
R146  Val: 24k9  [R_0402_1005Metric]  (hidden comment: CR0402-FX-2492GLF)
R147  Val: 200R  [R_0402_1005Metric]  (hidden comment: CR0402-FX-2000GLF)
R148  Val: 10k  [R_0402_1005Metric]  (hidden comment: CR0402-FX-1002GLF)
R149  Val: 10k  [R_0402_1005Metric]  (hidden comment: CR0402-FX-1002GLF)  (no BOM)
R150  Val: 10k  [R_0402_1005Metric]  (hidden comment: CR0402-FX-1002GLF)  (no BOM)
R151  Val: 200R  [R_0402_1005Metric]  (hidden comment: CR0402-FX-2000GLF)
R152  Val: 200R  [R_0402_1005Metric]  (hidden comment: CR0402-FX-2000GLF)
R153  Val: 10k  [R_0402_1005Metric]  (hidden comment: CR0402-FX-1002GLF)  (no BOM)
R154  Val: 24k9  [R_0402_1005Metric]  (hidden comment: CR0402-FX-2492GLF)
R155  Val: 1k  [R_0402_1005Metric]  (hidden comment: CR0402-FX-1001GLF)
R156  Val: 1k  [R_0402_1005Metric]  (hidden comment: CR0402-FX-1001GLF)
R157  Val: 0R  [R_0603_1608Metric]  (hidden comment: CR0603-J/-000ELF)  (no BOM)
R185  Val: 100k  [R_0402_1005Metric]  (hidden comment: CR0402-FX-1003GLF)
R196  Val: 63R4  [R_0603_1608Metric]  (hidden comment: CR0603-FX-63R4ELF)
R198  Val: 470k  [R_0402_1005Metric]  (hidden comment: CR0402-FX-4703GLF)
R199  Val: 470k  [R_0402_1005Metric]  (hidden comment: CR0402-FX-4703GLF)  (no BOM)
R229  Val: 100k  [R_0402_1005Metric]  (hidden comment: CR0402-FX-1003GLF)  (no BOM)
R241  Val: 0R  [R_0402_1005Metric]  (hidden comment: ERJ2GE0R00X)  (no BOM)
R243  Val: 0R  [R_0603_1608Metric]  (hidden comment: CR0603-J/-000ELF)  (no BOM)
U22  TPS2372-3RGWR  [VQFN-20_5x5x1mm_P0.65mm]  (value not drawn)
U23  ULS-12/5-D48N-C  [Conv_Murata_ULS-60W]  (value not drawn)
U39  ACPL-217-500E  [SOIC-4_4.55x2.6mm_P1.27mm]  (value not drawn)

### Ports
DISABLE_POE_DCDC (in), GBE_LED_ACT (in), GBE_LED_LINK (in), GBE_MDI0_N (in), GBE_MDI0_P (in), GBE_MDI1_N (in), GBE_MDI1_P (in), GBE_MDI2_N (in), GBE_MDI2_P (in), GBE_MDI3_N (in), GBE_MDI3_P (in), POE_OUTPUT (out)

### Nets
+3V3: J6.15(LED_GRN+) J6.17(LED_YEL+)
GND: C52.2 C77.1 C78.2 C84.1 C85.1 R147.1 R156.2 R157.1 U23.4(VOUT-) U23.5(SENSE-)
GNDD: C79.1 C80.1 C81.1 C82.1 D15.1(C) Q17.2(S) R155.1 R185.1 R229.1 U22.11(RTNA) U22.12(RTNB) U23.3(VIN-)
AMPS_CTL: R123.2 U22.8(AMPS_CTL)
CLSA: R196.2 U22.3(CLSA)
CLSB: R145.2 U22.6(CLSB)
DEN: R146.1 U22.2(DEN)
DISABLE_POE_DCDC: U39.1 ; port DISABLE_POE_DCDC
GBE_LED_ACT: R151.2 ; port GBE_LED_ACT
GBE_LED_LINK: R152.2 ; port GBE_LED_LINK
GBE_MDI0_N: J6.2(P2) ; port GBE_MDI0_N
GBE_MDI0_P: J6.1(P1) ; port GBE_MDI0_P
GBE_MDI1_N: J6.6(P6) ; port GBE_MDI1_N
GBE_MDI1_P: J6.3(P3) ; port GBE_MDI1_P
GBE_MDI2_N: J6.8(P8) ; port GBE_MDI2_N
GBE_MDI2_P: J6.7(P7) ; port GBE_MDI2_P
GBE_MDI3_N: J6.10(P10) ; port GBE_MDI3_N
GBE_MDI3_P: J6.9(P9) ; port GBE_MDI3_P
MPS_DUTY: R129.1 U22.9(MPS_DUTY)
PAIR_12: D12.3 J6.11(VC1)
PAIR_36: D12.4 J6.12(VC2)
PAIR_78: D13.4 J6.13(VC3)
PAIR_910: D13.3 J6.14(VC4)
PG: R148.2 U22.13(PG)
POE_ACTIVE: Q17.1(G) R148.1 R185.2 R198.1 R241.2 U39.4
POE_OUTPUT: C52.1 C84.2 C85.2 R243.1 U23.7(SENSE+) U23.8(VOUT+) ; port POE_OUTPUT
REF: R142.2 U22.7(REF)
TPH: R149.1 U22.18(TPH)
TPL: R150.1 U22.17(TPL)
ULS-12_CTRL: Q17.3(D) R199.1 R229.2 R241.1 U23.2(CTRL)
VDD: #FLG09.1(pwr) C76.2 C79.2 C80.2 C81.2 C82.2 D14.1(C) FB2.2 R146.2 R149.2 R150.2 R153.2 R154.2 R198.2 R199.2 U22.1(VDD) U23.1(VIN+)
VSS: #FLG010.1(pwr) C76.1 D14.2(A) FB3.2 R123.1 R129.2 R142.1 R145.1 R196.1 U22.4(VSSA) U22.5(VSSB) U22.21(PAD_VSSC)
~{{BT}}: R153.1 U22.19(~{{BT}})
NetC77_2: C77.2 J6.4(P4) J6.5(P5)
NetC78_1: C78.1 J6.19(SHIELD) R147.2
NetD12_1: D12.1 D13.1 FB3.1
NetD12_2: D12.2 D13.2 FB2.1
NetD15_2: D15.2(A) R154.1
NetJ6_16: J6.16(LED_GRN-) R152.1
NetJ6_18: J6.18(LED_YEL-) R151.1
NetR155_2: R155.2 U39.3
NetR156_1: R156.1 U39.2
NetR157_2: R157.2 R243.2 U23.6(TRIM)

Not connected (* = marked no-connect by the designer): J6 20(SHIELD); U22 10(~{{AUTCLS}})* 14(NC) 15(NC) 16(IRSHDL_EN)* 20(NC)

### Notes on the sheet
- Ethernet Connector
- Power over Ethernet
- 1/5.7 divider
- ADAPTED FROM APACHE2 LICENSED WORK BY <https://github.com/antmicro/jetson-orin-baseboard>
- 1
- 2
- 3
- 4
- 5
- 6
- 7
- 8
- A
- B
- C
- D
- E
- www.antmicro.com <http://www.antmicro.com>
- Title: Jetson Orin Baseboard
- File: ethernet.kicad_sch
- Sheet: /
- Antmicro Ltd
- F
- KiCad E.D.A.  kicad (5.1.4)-1
- Size: A3
- Date: 2025-01-15
- Rev: 1.3.0
- Id: 1/1

### Library data of the parts
C52 C78 = C_100n_0402: as C42 on sheet csi; Author: Antmicro; OldValue: C_100n_0402; Manufacturer Part Number 1: GRM155R61H104KE14D; Value: GRM155R61H104KE14D; Footprint: antmicro-footprints:C_0402_1005Metric
C76 = C_100n_100V_0805: Manufacturer 1: Samsung Electro-Mechanics; License: Apache-2.0; Dielectric: X7R; Public: False; Author: Antmicro; OldValue: C_100n_100V_0805; Manufacturer Part Number 1: CL21B104KCFNNNE; Value: CL21B104KCFNNNE; Footprint: antmicro-footprints:C_0805_2012Metric
C77 = C_10n_0603: Manufacturer 1: AVX; License: Apache-2.0; Author: Antmicro; OldValue: C_10n_0603; Manufacturer Part Number 1: 06031C103JAT2A; Value: 06031C103JAT2A; Footprint: antmicro-footprints:C_0603_1608Metric
C79-C82 = C_22u_100V_2220: Manufacturer 1: TDK; License: Apache-2.0; Dielectric: X7S; Public: False; Author: Antmicro; OldValue: C_22u_100V_2220; Manufacturer Part Number 1: C5750X7S2A226M280KB; Value: C5750X7S2A226M280KB; Footprint: antmicro-footprints:C_2220_5650Metric
C84 C85 = C_47u_16V_1206: Manufacturer 1: TDK; License: Apache-2.0; Dielectric: X5R; Public: False; Author: Antmicro; OldValue: C_47u_16V_1206; Manufacturer Part Number 1: C3216X5R1C476M160AB; Value: C3216X5R1C476M160AB; Footprint: antmicro-footprints:C_1206_3216Metric
D12 D13 = CD-MMBL110S: Manufacturer 1: Bourns; License: Apache-2.0; Author: Antmicro; OldValue: CD-MMBL110S; Manufacturer Part Number 1: CD-MMBL110S; Value: CD-MMBL110S; Footprint: antmicro-footprints:DFN3538
D14 = PTVS58VS1UR,115: Manufacturer 1: Nexperia; License: Apache-2.0; Author: Antmicro; OldValue: PTVS58VS1UR,115; Manufacturer Part Number 1: PTVS58VS1UR,115; Value: PTVS58VS1UR,115; Footprint: antmicro-footprints:D_SOD-123F
D15 = LED_G_0603_LTST-C190GKT: as D18 on sheet csi; Author: Antmicro; OldValue: LED_G_0603_LTST-C190GKT; Manufacturer Part Number 1: LTST-C190GKT; Value: LTST-C190GKT; Footprint: antmicro-footprints:LED_0603_1608Metric_G
FB2 FB3 = FB_220Z_2A_Murata-BLM21PG_0805: Manufacturer 1: Murata; License: Apache-2.0; Author: Antmicro; OldValue: FB_220Z_2A_Murata-BLM21PG_0805; Manufacturer Part Number 1: BLM21PG221SN1D; Value: BLM21PG221SN1D; Footprint: antmicro-footprints:FB_0805_2012Metric
J6 = Bus_RJ45_5-2337992-8: Manufacturer 1: TE Connectivity; License: Apache-2.0; Author: Antmicro; OldValue: Bus_RJ45_5-2337992-8; Manufacturer Part Number 1: 5-2337992-8; Value: 5-2337992-8; Footprint: antmicro-footprints:RJ45_X-2337992-8_Horizontal
Q17 = PJE138K: Manufacturer 1: PANJIT; License: Apache-2.0; Author: Antmicro; OldValue: PJE138K; Manufacturer Part Number 1: PJE138K_R1_00001; Value: PJE138K_R1_00001; Footprint: antmicro-footprints:SOT-523
R123 = R_1k3_0402: Manufacturer 1: Bourns; License: Apache-2.0; Tolerance: 1%; Author: Antmicro; OldValue: R_1k3_0402; Manufacturer Part Number 1: CR0402-FX-1301GLF; Value: CR0402-FX-1301GLF; Footprint: antmicro-footprints:R_0402_1005Metric
R129 R241 = R_0R_0402: as R1-R5 on sheet som; Author: Antmicro; OldValue: R_0R_0402; Manufacturer Part Number 1: ERJ2GE0R00X; Value: ERJ2GE0R00X; Footprint: antmicro-footprints:R_0402_1005Metric
R142 = R_49k9_0402: Manufacturer 1: Bourns; License: Apache-2.0; Tolerance: 1%; Author: Antmicro; OldValue: R_49k9_0402; Manufacturer Part Number 1: CR0402-FX-4992GLF; Value: CR0402-FX-4992GLF; Footprint: antmicro-footprints:R_0402_1005Metric
R145 = R_1k2_0402: Manufacturer 1: Bourns; License: Apache-2.0; Tolerance: 1%; Author: Antmicro; OldValue: R_1k2_0402; Manufacturer Part Number 1: CR0402-FX-1201GLF; Value: CR0402-FX-1201GLF; Footprint: antmicro-footprints:R_0402_1005Metric
R146 R154 = R_24k9_0402: Manufacturer 1: Bourns; License: Apache-2.0; Tolerance: 1%; Author: Antmicro; OldValue: R_24k9_0402; Manufacturer Part Number 1: CR0402-FX-2492GLF; Value: CR0402-FX-2492GLF; Footprint: antmicro-footprints:R_0402_1005Metric
R147 R151 R152 = R_200R_0402: as R132 on sheet csi; Author: Antmicro; OldValue: R_200R_0402; Manufacturer Part Number 1: CR0402-FX-2000GLF; Value: CR0402-FX-2000GLF; Footprint: antmicro-footprints:R_0402_1005Metric
R148-R150 R153 = R_10k_0402: as R66 on sheet csi; Author: Antmicro; OldValue: R_10k_0402; Manufacturer Part Number 1: CR0402-FX-1002GLF; Value: CR0402-FX-1002GLF; Footprint: antmicro-footprints:R_0402_1005Metric
R155 R156 = R_1k_0402: Manufacturer 1: Bourns; License: Apache-2.0; Tolerance: 1%; Author: Antmicro; OldValue: R_1k_0402; Manufacturer Part Number 1: CR0402-FX-1001GLF; Value: CR0402-FX-1001GLF; Footprint: antmicro-footprints:R_0402_1005Metric
R157 R243 = R_0R_0603: Manufacturer 1: Bourns; License: Apache-2.0; Tolerance: ~; Current: 1A; Author: Antmicro; OldValue: R_0R_0603; Manufacturer Part Number 1: CR0603-J/-000ELF; Value: CR0603-J/-000ELF; Footprint: antmicro-footprints:R_0603_1608Metric
R185 R229 = R_100k_0402: as R6 on sheet csi; Author: Antmicro; OldValue: R_100k_0402; Manufacturer Part Number 1: CR0402-FX-1003GLF; Value: CR0402-FX-1003GLF; Footprint: antmicro-footprints:R_0402_1005Metric
R196 = R_63R4_0603: Manufacturer 1: Bourns; License: Apache-2.0; Tolerance: 1%; Author: Antmicro; OldValue: R_63R4_0603; Manufacturer Part Number 1: CR0603-FX-63R4ELF; Value: CR0603-FX-63R4ELF; Footprint: antmicro-footprints:R_0603_1608Metric
R198 R199 = R_470k_0402: Manufacturer 1: Bourns; License: Apache-2.0; Tolerance: 1%; Author: Antmicro; OldValue: R_470k_0402; Manufacturer Part Number 1: CR0402-FX-4703GLF; Value: CR0402-FX-4703GLF; Footprint: antmicro-footprints:R_0402_1005Metric
U22 = TPS2372-3RGWR: Manufacturer 1: Texas Instruments; License: Apache-2.0; Author: Antmicro; OldValue: TPS2372-3RGWR; Manufacturer Part Number 1: TPS2372-3RGWR; Value: TPS2372-3RGWR; Footprint: antmicro-footprints:VQFN-20_5x5x1mm_P0.65mm
U23 = ULS-12_5-D48N-C: Manufacturer 1: Murata; License: Apache-2.0; Alternatives 50W: VCB4812SBO-50WR3, V36SE12004NRFA, PKU5513ESI, KHHD004A2B41Z; Alternatives 75W: VCB4812SBO-75WR3; Alternatives 100W: PKU4913DPIHS, VCB4812SBO-100WFR3; Alternatives 120W: PQC50-48-S12-O; Author: Antmicro; OldValue: ULS-12_5-D48N-C; Manufacturer Part Number 1: ULS-12/5-D48N-C; Value: ULS-12/5-D48N-C; Footprint: antmicro-footprints:Conv_Murata_ULS-60W
U39 = ACPL-217-500E: Manufacturer 1: Broadcom; License: Apache-2.0; Author: Antmicro; OldValue: ACPL-217-500E; Manufacturer Part Number 1: ACPL-217-500E; Value: ACPL-217-500E; Footprint: antmicro-footprints:SOIC-4_4.55x2.6mm_P1.27mm
#FLG09 #FLG010 = PWR_FLAG: Value: PWR_FLAG